# EAGLE design microdronesmd (EAGLE 9.2.2)
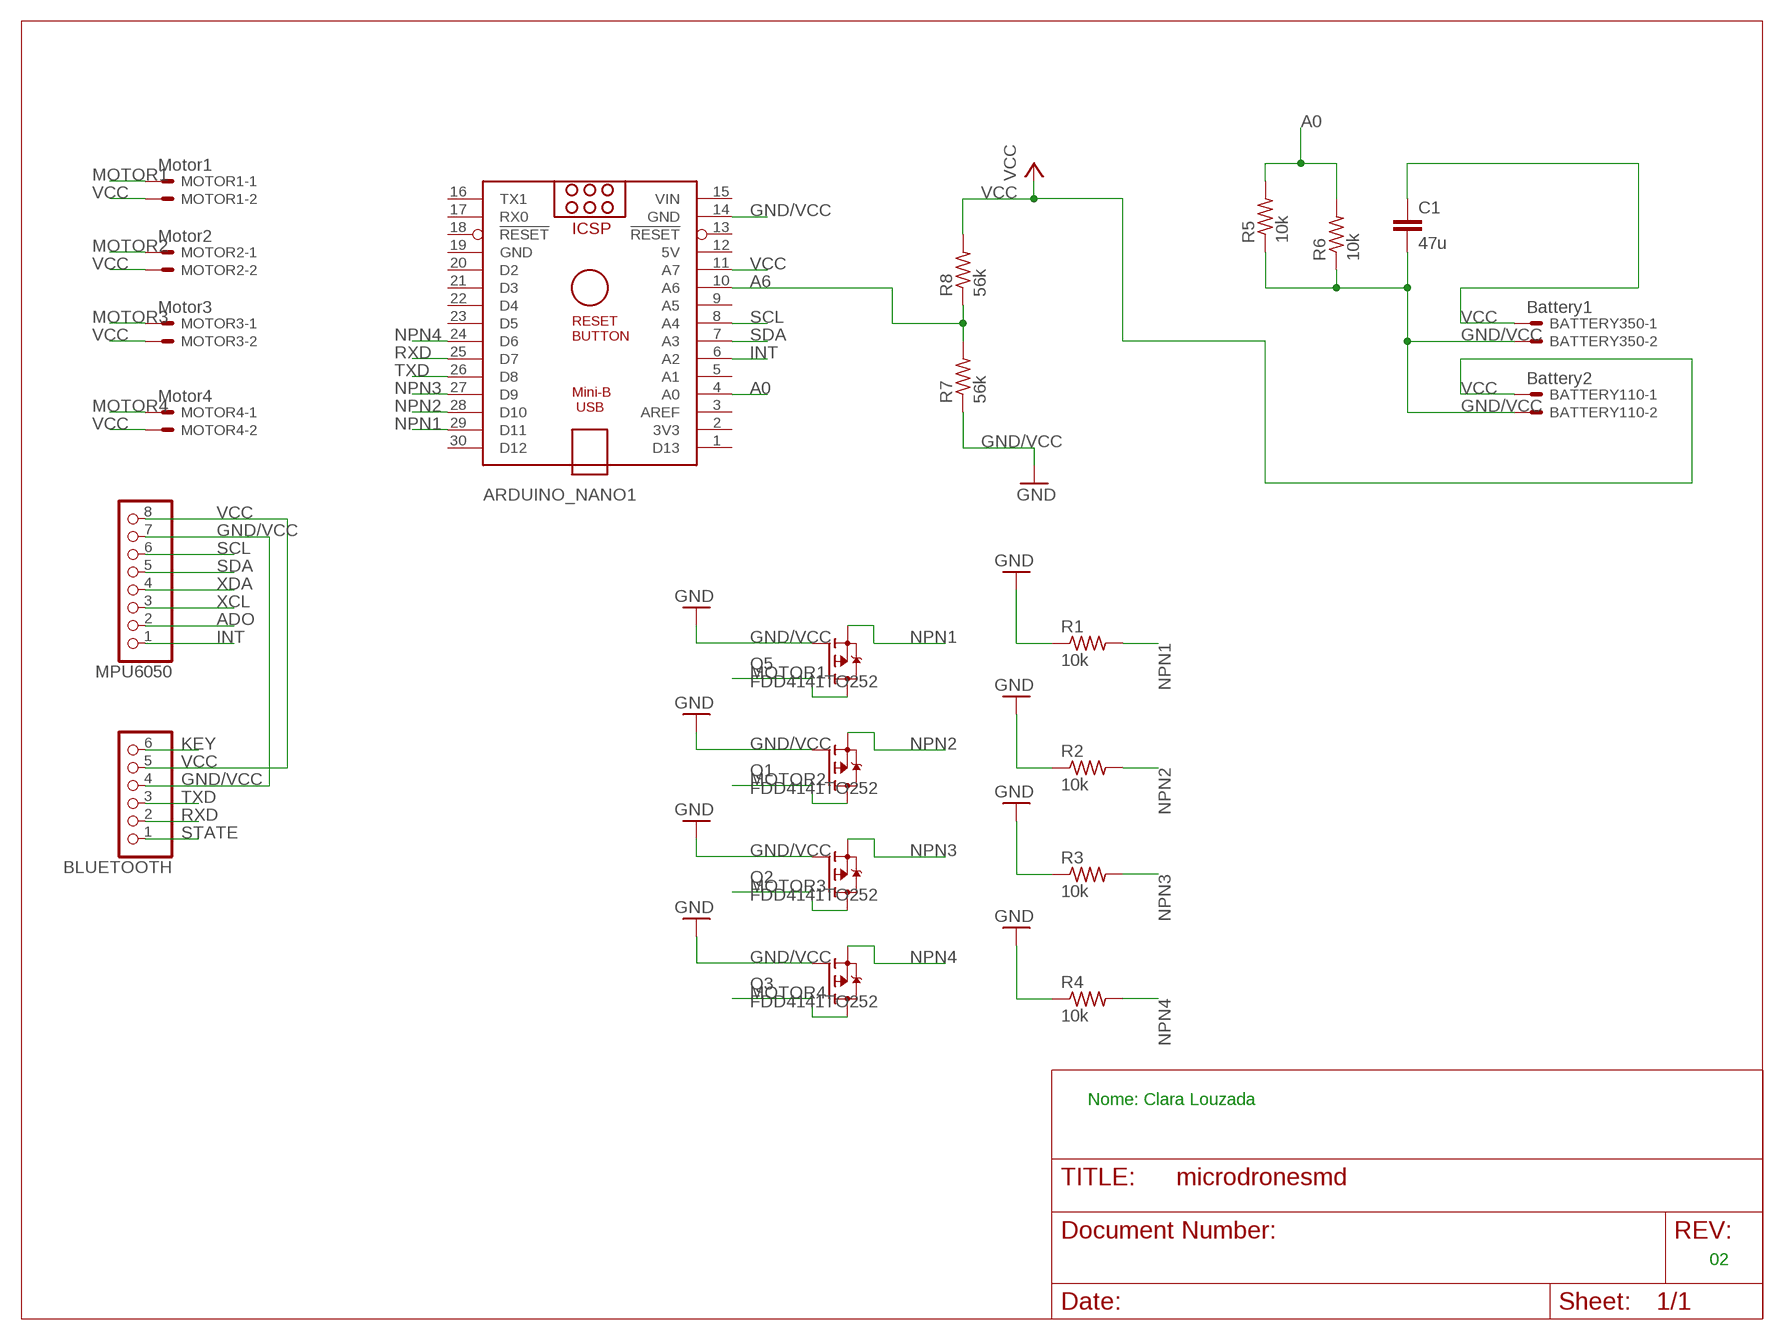
[diagram p0: schematic, sheet 1]

## Parts
ARDUINO_NANO1  ARDUINO_NANO  [ARDUINO_NANO]
BATTERY110  Battery2  JST-XH-02-PIN-LONG-PAD  [JST-XH-02-PACKAGE-LONG-PAD]
BATTERY350  Battery1  JST-XH-02-PIN-LONG-PAD  [JST-XH-02-PACKAGE-LONG-PAD]
BLUETOOTH  PINHD-1X6  [1X06]
C1  47u  C2,5-3  [C2.5-3]
MOTOR1  Motor1  JST-XH-02-PIN-LONG-PAD  [JST-XH-02-PACKAGE-LONG-PAD]
MOTOR2  Motor2  JST-XH-02-PIN-LONG-PAD  [JST-XH-02-PACKAGE-LONG-PAD]
MOTOR3  Motor3  JST-XH-02-PIN-LONG-PAD  [JST-XH-02-PACKAGE-LONG-PAD]
MOTOR4  Motor4  JST-XH-02-PIN-LONG-PAD  [JST-XH-02-PACKAGE-LONG-PAD]
MPU6050  PINHD-1X8  [1X08]
Q1  FDD4141TO252  [TO252]
Q2  FDD4141TO252  [TO252]
Q3  FDD4141TO252  [TO252]
Q5  FDD4141TO252  [TO252]
R1  10k  R-US_0204/7  [0204/7]
R2  10k  R-US_0204/7  [0204/7]
R3  10k  R-US_0204/7  [0204/7]
R4  10k  R-US_0204/7  [0204/7]
R5  10k  R-US_0204/7  [0204/7]
R6  10k  R-US_0204/7  [0204/7]
R7  56k  R-US_0204/7  [0204/7]
R8  56k  R-US_0204/7  [0204/7]

## Nets
A0: ARDUINO_NANO1.4(A0) R5.2 R6.2
A6: ARDUINO_NANO1.10(A6) R7.2 R8.1
ADO: MPU6050.2
GND/VCC: ARDUINO_NANO1.14(GND) BATTERY110.2 BATTERY350.2 BLUETOOTH.4 C1.2 MPU6050.7 Q1.1(G) Q2.1(G) Q3.1(G) Q5.1(G) R1.1 R2.1 R3.1 R4.1 R5.1 R6.1 R7.1 ; supply symbol labelled GND
INT: ARDUINO_NANO1.6(A2) MPU6050.1
KEY: BLUETOOTH.6
MOTOR1: MOTOR1.1 Q5.3(D)
MOTOR2: MOTOR2.1 Q1.3(D)
MOTOR3: MOTOR3.1 Q2.3(D)
MOTOR4: MOTOR4.1 Q3.3(D)
NPN1: ARDUINO_NANO1.29(D11) Q5.2(S) R1.2
NPN2: ARDUINO_NANO1.28(D10) Q1.2(S) R2.2
NPN3: ARDUINO_NANO1.27(D9) Q2.2(S) R3.2
NPN4: ARDUINO_NANO1.24(D6) Q3.2(S) R4.2
RXD: ARDUINO_NANO1.25(D7) BLUETOOTH.2
SCL: ARDUINO_NANO1.8(A4) MPU6050.6
SDA: ARDUINO_NANO1.7(A3) MPU6050.5
STATE: BLUETOOTH.1
TXD: ARDUINO_NANO1.26(D8) BLUETOOTH.3
VCC: ARDUINO_NANO1.11(A7) BATTERY110.1 BATTERY350.1 BLUETOOTH.5 C1.1 MOTOR1.2 MOTOR2.2 MOTOR3.2 MOTOR4.2 MPU6050.8 R8.2
XCL: MPU6050.3
XDA: MPU6050.4
Unconnected: ARDUINO_NANO1.1(D13) ARDUINO_NANO1.2(3V3) ARDUINO_NANO1.3(AREF) ARDUINO_NANO1.5(A1) ARDUINO_NANO1.9(A5) ARDUINO_NANO1.13(!RESET) ARDUINO_NANO1.16(TX1) ARDUINO_NANO1.17(RX0) ARDUINO_NANO1.18(!RESET) ARDUINO_NANO1.20(D2) ARDUINO_NANO1.21(D3) ARDUINO_NANO1.22(D4) ARDUINO_NANO1.23(D5) ARDUINO_NANO1.30(D12)

## Notes on the sheet
- Nome: Clara Louzada
- 02

## Power pins joined to a net without a drawn wire
5V: ARDUINO_NANO1.12(5V)
GND/VCC: ARDUINO_NANO1.19(GND)
VIN: ARDUINO_NANO1.15(VIN)

## Library data of the parts
ARDUINO_NANO1 = ArduinoNanoV30:ARDUINO_NANO: Arduino Nano V3.0 Overview: The Arduino Nano is a small, complete, and breadboard-friendly board based on the ATmega328 (Arduino Nano 3.x) or ATmega168 (Arduino Nano 2.x). It has more or less the same functionality of the Arduino Duemilanove, but in a different package. It lacks only a DC power jack, and works with a Mini-B USB cable instead of a standard one. The Nano was designed and is being produced by Gravitech. Specifications: Microcontroller Atmel ATmega168 or ATmega328 Operating Voltage (logic level) 5 V Input Voltage (recommended) 7-12 V Input Voltage (limits) 6-20 V Digital I/O Pins 14 (of which 6 provide PWM output) Analog Input Pins 8 DC Current per I/O Pin 40 mA Flash Memory 16 KB (ATmega168) or 32 KB (ATmega328) of which 2 KB used by bootloader SRAM 1 KB (ATmega168) or 2 KB (ATmega328) EEPROM 512 bytes (ATmega168) or 1 KB (ATmega328) Clock Speed 16 MHz Dimensions 0.73" x 1.70" Length 45 mm Width 18 mm Weigth 5 g Power: The Arduino Nano can be powered via the Mini-B USB connection, 6-20V unregulated external power supply (pin 30), or 5V regulated external power supply (pin 27). The power source is automatically selected to the highest voltage source. Memory: The ATmega168 has 16 KB of flash memory for storing code (of which 2 KB is used for the bootloader); the ATmega328 has 32 KB, (also with 2 KB used for the bootloader). The ATmega168 has 1 KB of SRAM and 512 bytes of EEPROM (which can be read and written with the EEPROM library); the ATmega328 has 2 KB of SRAM and 1 KB of EEPROM. Input and Output: Each of the 14 digital pins on the Nano can be used as an input or output, using pinMode(), digitalWrite(), and digitalRead() functions. They operate at 5 volts. Each pin can provide or receive a maximum of 40 mA and has an internal pull-up resistor (disconnected by default) of 20-50 kOhms. In addition, some pins have specialized functions. Visit Arduino - ArduinoBoardNano <https://www.arduino.cc/en/Main/ArduinoBoardNano>
BATTERY110 BATTERY350 MOTOR1-MOTOR4 = Rembrandt Electronics - JST XH Connectors v1-0:JST-XH-02-PIN: JST XH Connector 2 Pin Wire to board connector. Pitch: 2,54 mm, (0.100") Number of pins: 2 Created by Rembrandt Electronics www.rembrandtelectronics.com
BLUETOOTH = pinhead:PINHD-1X6: PIN HEADER
C1 = capacitor-wima:C: CAPACITOR naming: grid - package width
MPU6050 = pinhead:PINHD-1X8: PIN HEADER
Q1-Q3 Q5 = transistor-fet:FDD4141: P-Channel PowerTrench® MOSFET Source: FDD4141.pdf
R1-R8 = resistor:R-US_: RESISTOR, American symbol

## Board
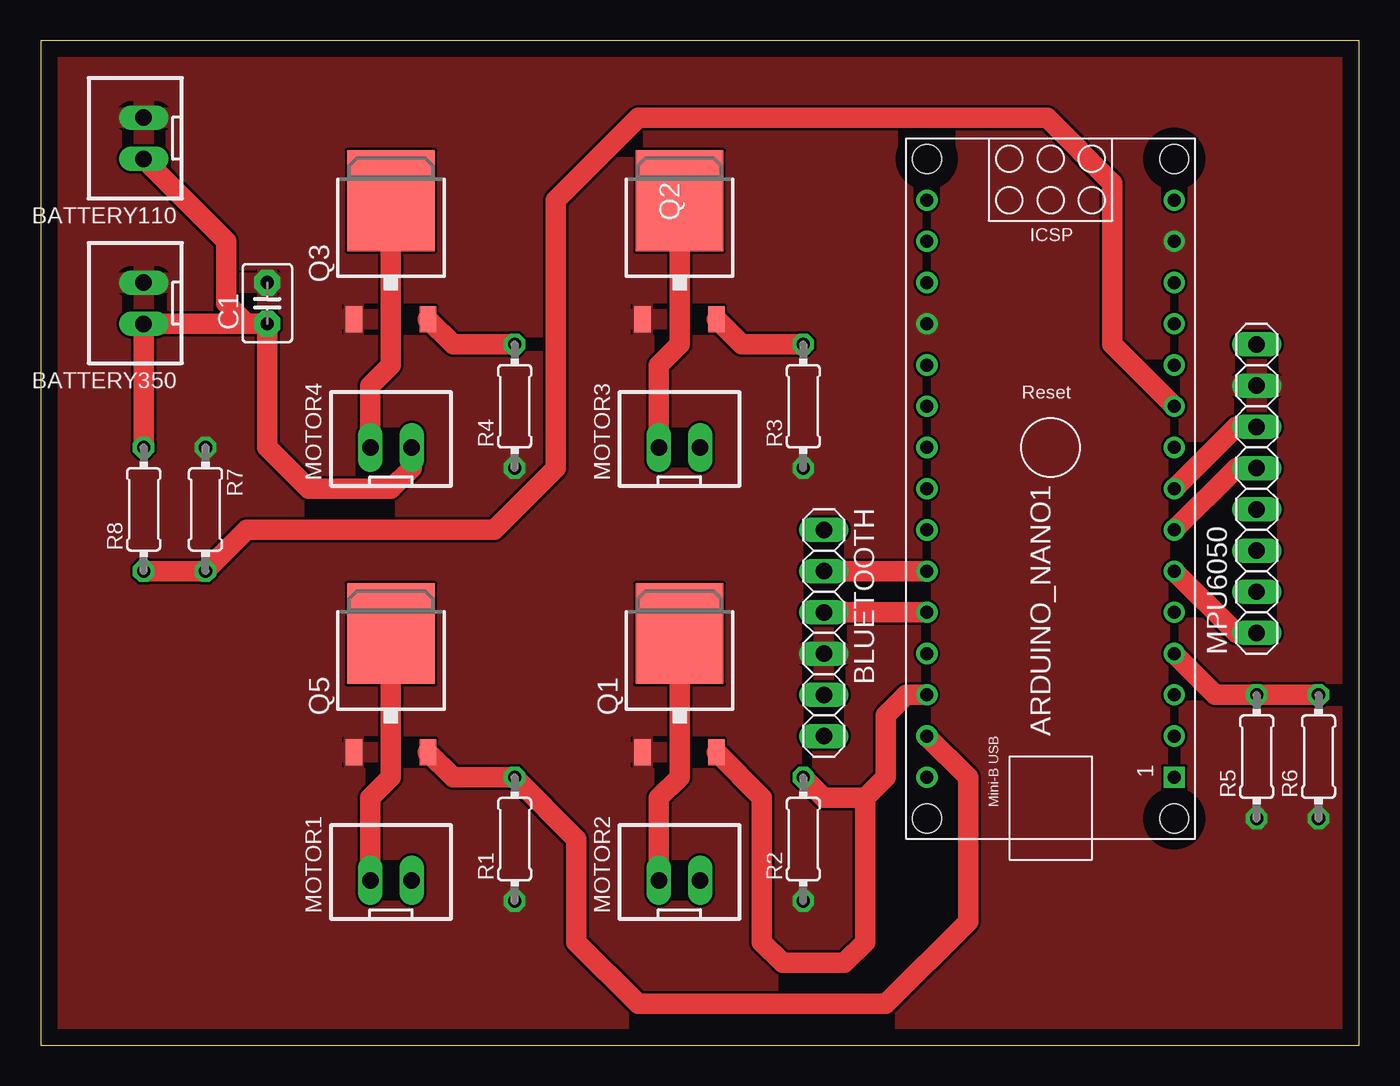
[diagram p1: board, top side]
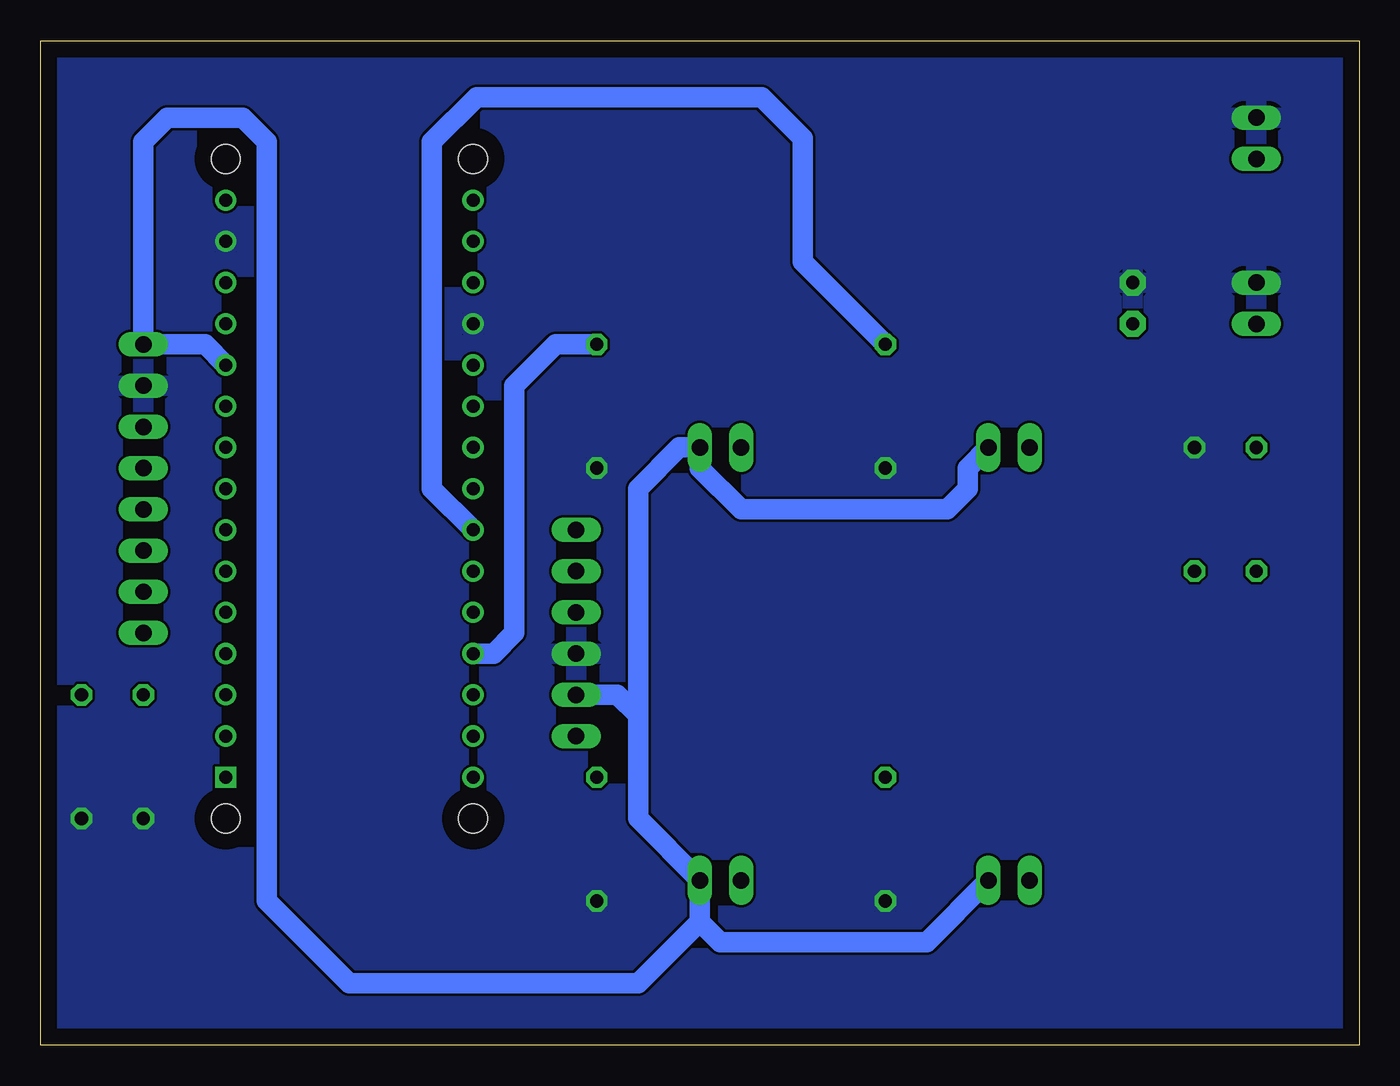
[diagram p2: board, bottom side, seen from below]

Size 81.26 x 61.9 mm. Coordinates in mm from the lower left corner, seen from the top.
Outline: 0,0 81.26,0 81.26,61.9 0,61.9 0,0
Copper layers (1*16): Top 0.035mm / dielectric 1.5mm / Bottom 0.035mm
Design rules "default": minimum track width 6mil, minimum drill 0.35mm, track to track 6mil, track to pad 6mil, pad to pad 6mil, via to via 6mil, smd to smd 6mil, copper to edge 40mil, drill to drill 6mil, minimum pad ring 10mil, minimum via ring 8mil, stop-mask expansion 4mil, vias tented up to drill 0mil, thermal gap 10mil

### Footprints (pad centres in the part's own frame; a part is rotated, then mirrored left to right if it is on the bottom)
ARDUINO_NANO = drill 0.8 square: 1 -20.32,-7.62 | drill 0.8: 2 -17.78,-7.62; 3 -15.24,-7.62; 4 -12.7,-7.62; 5 -10.16,-7.62; 6 -7.62,-7.62; 7 -5.08,-7.62; 8 -2.54,-7.62; 9 0,-7.62; 10 2.54,-7.62; 11 5.08,-7.62; 12 7.62,-7.62; 13 10.16,-7.62; 14 12.7,-7.62; 15 15.24,-7.62; 16 15.24,7.62; 17 12.7,7.62; 18 10.16,7.62; 19 7.62,7.62; 20 5.08,7.62; 21 2.54,7.62; 22 0,7.62; 23 -2.54,7.62; 24 -5.08,7.62; 25 -7.62,7.62; 26 -10.16,7.62; 27 -12.7,7.62; 28 -15.24,7.62; 29 -17.78,7.62; 30 -20.32,7.62 | hole 1.778: -22.86,-7.62; -22.86,7.62; 17.78,7.62; 17.78,-7.62
JST-XH-02-PACKAGE-LONG-PAD = drill 1.016 long: 1 -1.27,0; 2 1.27,0
1X06 = drill 1.016 long: 1 -6.35,0; 2 -3.81,0; 3 -1.27,0; 4 1.27,0; 5 3.81,0; 6 6.35,0
C2.5-3 = drill 0.813 pad 1.6 octagon: 1 -1.27,0; 2 1.27,0
1X08 = drill 1.016 long: 1 -8.89,0; 2 -6.35,0; 3 -3.81,0; 4 -1.27,0; 5 1.27,0; 6 3.81,0; 7 6.35,0; 8 8.89,0
TO252 = smd 1 x 1.6: 1 -2.28,-4.8; 2 2.28,-4.8 | smd 5.4 x 6.2: 3 0,2.5
0204/7 = drill 0.813 octagon: 1 -3.81,0; 2 3.81,0

### Placement (x,y rotation side)
ARDUINO_NANO1  62.23,36.83 90 top
BATTERY110  6.35,55.88 90 top
BATTERY350  6.35,45.72 90 top
BLUETOOTH  48.26,25.4 270 top
C1  13.97,45.72 90 top
MOTOR1  21.59,10.16 0 top
MOTOR2  39.37,10.16 0 top
MOTOR3  39.37,36.83 0 top
MOTOR4  21.59,36.83 0 top
MPU6050  74.93,34.29 90 top
Q1  39.37,22.86 0 top
Q2  39.37,49.53 0 top
Q3  21.59,49.53 0 top
Q5  21.59,22.86 0 top
R1  29.21,12.7 90 top
R2  46.99,12.7 90 top
R3  46.99,39.37 90 top
R4  29.21,39.37 90 top
R5  74.93,17.78 90 top
R6  78.74,17.78 90 top
R7  10.16,33.02 270 top
R8  6.35,33.02 90 top

### Tracks (layer width: path | path; a pad name or v marks a point on that pad's centre or on a via)
A0
  Top 1.27: ARDUINO_NANO1.4 72.39,21.59 R5.2 76.2,21.59 R6.2
A6
  Top 1.27: R8.1 R7.2 12.7,31.75 27.94,31.75 31.75,35.56 31.75,52.07 36.83,57.15 62.01,57.15 66.04,53.12 66.04,43.18 ARDUINO_NANO1.10
GND/VCC
  pour Top: 0,62.23 81.28,62.23 81.28,0 0,0
  pour Bottom: 0,62.23 81.28,62.23 81.28,0 0,0
INT
  Top 1.27: ARDUINO_NANO1.6 73.66,25.4 MPU6050.1
MOTOR1
  Top 1.27: MOTOR1.1 20.32,15.24 21.59,16.51 Q5.3
MOTOR2
  Top 1.27: MOTOR2.1 38.1,15.24 39.37,16.51 Q1.3
MOTOR3
  Top 1.27: MOTOR3.1 38.1,41.91 39.37,43.18 Q2.3
MOTOR4
  Top 1.27: MOTOR4.1 20.32,40.64 21.59,41.91 Q3.3
NPN1
  Top 1.27: Q5.2 25.42,16.51 R1.2 33.02,12.7 33.02,6.35 36.83,2.54 52.07,2.54 57.15,7.62 57.15,16.51 ARDUINO_NANO1.29
NPN2
  Top 1.27: Q1.2 44.45,15.26 44.45,6.35 45.72,5.08 49.53,5.08 50.8,6.35 50.8,15.24 | 50.8,15.24 48.26,15.24 R2.2 | 50.8,15.24 52.07,16.51 52.07,20.32 53.34,21.59 ARDUINO_NANO1.28
NPN3
  Top 1.27: Q2.2 43.2,43.18 R3.2
  Bottom 1.27: R3.2 49.53,43.18 52.07,40.64 52.07,25.4 53.34,24.13 ARDUINO_NANO1.27
NPN4
  Top 1.27: Q3.2 25.42,43.18 R4.2
  Bottom 1.27: R4.2 34.29,48.26 34.29,55.88 36.83,58.42 54.39,58.42 57.15,55.66 57.15,34.29 ARDUINO_NANO1.24
RXD
  Top 1.27: BLUETOOTH.2 ARDUINO_NANO1.25
SCL
  Top 1.27: ARDUINO_NANO1.8 73.66,38.1 MPU6050.6
SDA
  Top 1.27: ARDUINO_NANO1.7 73.66,35.56 MPU6050.5
TXD
  Top 1.27: BLUETOOTH.3 ARDUINO_NANO1.26
VCC
  Top 1.27: BATTERY110.1 11.43,49.53 11.43,45.72 12.7,44.45 | 12.7,44.45 C1.1 13.97,36.83 16.51,34.29 21.59,34.29 22.86,35.56 MOTOR4.2 | 12.7,44.45 BATTERY350.1 R8.2
  Bottom 1.27: MOTOR1.2 26.67,6.35 39.37,6.35 40.64,7.62 | 40.64,7.62 MOTOR2.2 44.45,13.97 44.45,20.32 | 44.45,20.32 45.72,21.59 BLUETOOTH.5 | 44.45,20.32 44.45,34.29 41.91,36.83 MOTOR3.2 40.64,35.56 38.1,33.02 25.4,33.02 24.13,34.29 24.13,35.56 MOTOR4.2 | 40.64,7.62 44.45,3.81 62.23,3.81 67.31,8.89 67.31,55.66 68.8,57.15 73.44,57.15 74.93,55.66 MPU6050.8 71.12,43.18 ARDUINO_NANO1.11